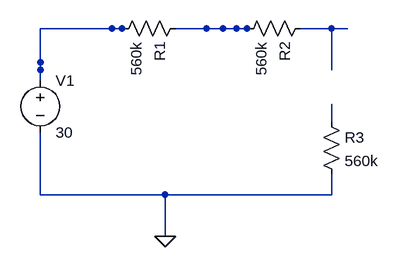
[diagram p0: schematic pannel_1.asc]
pannel_1.asc, the LTspice schematic file:
Version 4
SHEET 1 880 680
WIRE 528 320 601 320
WIRE 430 320 446 320
SYMBOL res 544 304 R90
SYMATTR InstName R1
SYMATTR Value 560k
WIRE 720 320 793 320
WIRE 622 320 638 320
SYMBOL res 736 304 R90
SYMATTR InstName R2
SYMATTR Value 560k
WIRE 768 464 768 436
WIRE 768 576 768 544
SYMBOL res 752 448 R0
SYMATTR InstName R3
SYMATTR Value 560k
FLAG 512 640 0
WIRE 320 400 320 372
WIRE 320 512 320 480
SYMBOL voltage 320 384 R0
SYMATTR InstName V1
SYMATTR Value 30
WIRE 768 320 768 384
WIRE 704 576 768 576
WIRE 512 576 512 640
WIRE 512 576 576 576
WIRE 448 576 512 576
WIRE 320 512 320 576
WIRE 320 576 384 576
WIRE 320 320 320 384
WIRE 320 320 384 320
WIRE 384 576 448 576
WIRE 576 576 640 576
WIRE 640 576 704 576
WIRE 576 320 640 320
WIRE 384 320 448 320

The netlist it stands for:
* pannel_1.asc
R1 N001 N002 560k
R2 N003 N001 560k
R3 N004 0 560k
V1 N002 0 30
.backanno
.end